# EAGLE schematic HDMI_DLT (EAGLE 9.4.2)
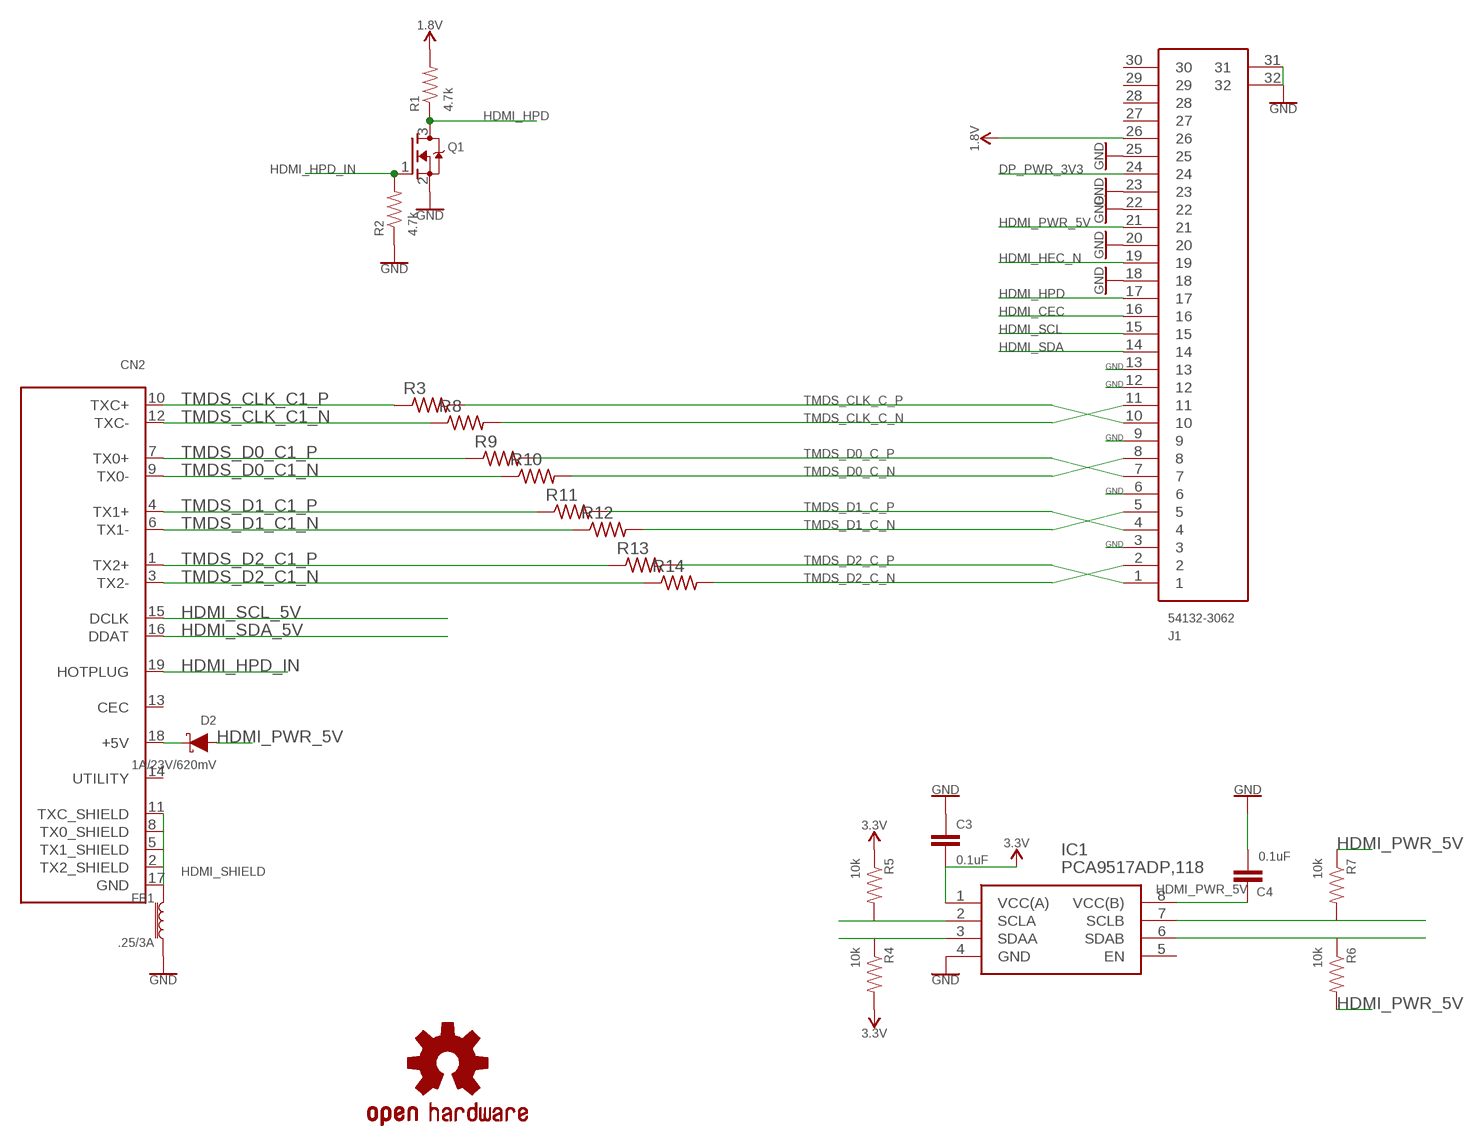
[diagram p0: schematic, sheet 1]

## Parts
C3  0.1uF  10NF-0603-50V-10%  [0603]
C4  0.1uF  10NF-0603-50V-10%  [0603]
CN2  HDMI_MOLEX_47151-0001  [HDMI_MOLEX_47151-0001]
D2  1A/23V/620mV  DIODE-SCHOTTKY-BAT20J  [SOD-323]
FB1  .25/3A  FERRITE_BEAD-0603  [0603]
IC1  PCA9517ADP,118  [SOP65P490X110-8N]
J1  54132-3062  [54132-3062]
LOGO1  OSHW-LOGOS-COPPER  [OSHW-LOGO-S_COPPER]
Q1  MOSFET-NWAVE  [SOT23-W]
R1  4.7k  RESISTOR0805-RES  [0805]
R2  4.7k  RESISTOR0805-RES  [0805]
R3  R-US_R0402  [R0402]
R4  10k  RESISTOR0805-RES  [0805]
R5  10k  RESISTOR0805-RES  [0805]
R6  10k  RESISTOR0805-RES  [0805]
R7  10k  RESISTOR0805-RES  [0805]
R8  R-US_R0402  [R0402]
R9  R-US_R0402  [R0402]
R10  R-US_R0402  [R0402]
R11  R-US_R0402  [R0402]
R12  R-US_R0402  [R0402]
R13  R-US_R0402  [R0402]
R14  R-US_R0402  [R0402]

## Nets
1.8V: J1.26 R1.2
3.3V: C3.2 IC1.1(VCC(A)) R4.2 R5.1
DP_PWR_3V3: J1.24
GND: C3.1 C4.2 FB1.2 IC1.4(GND) J1.3 J1.6 J1.9 J1.12 J1.13 J1.18 J1.20 J1.22 J1.23 J1.25 J1.31 J1.32 Q1.2(S) R2.1
HDMI_5V_DIODE1: CN2.18(+5V) D2.C
HDMI_CEC: J1.16
HDMI_HEC_N: J1.19
HDMI_HPD: J1.17 Q1.3(D) R1.1
HDMI_HPD_IN: CN2.19(HOTPLUG) Q1.1(G) R2.2
HDMI_PWR_5V: C4.1 D2.A IC1.8(VCC(B)) J1.21 R6.2 R7.1
HDMI_SCL: IC1.2(SCLA) J1.15 R5.2
HDMI_SCL_5V: CN2.15(DCLK) IC1.7(SCLB) R7.2
HDMI_SDA: IC1.3(SDAA) J1.14 R4.1
HDMI_SDA_5V: CN2.16(DDAT) IC1.6(SDAB) R6.1
HDMI_SHIELD: CN2.2(TX2_SHIELD) CN2.5(TX1_SHIELD) CN2.8(TX0_SHIELD) CN2.11(TXC_SHIELD) CN2.17(GND) FB1.1
TMDS_CLK_C1_N: CN2.12(TXC-) R8.1
TMDS_CLK_C1_P: CN2.10(TXC+) R3.1
TMDS_CLK_C_N: J1.11 R8.2
TMDS_CLK_C_P: J1.10 R3.2
TMDS_D0_C1_N: CN2.9(TX0-) R10.1
TMDS_D0_C1_P: CN2.7(TX0+) R9.1
TMDS_D0_C_N: J1.8 R10.2
TMDS_D0_C_P: J1.7 R9.2
TMDS_D1_C1_N: CN2.6(TX1-) R12.1
TMDS_D1_C1_P: CN2.4(TX1+) R11.1
TMDS_D1_C_N: J1.5 R12.2
TMDS_D1_C_P: J1.4 R11.2
TMDS_D2_C1_N: CN2.3(TX2-) R14.1
TMDS_D2_C1_P: CN2.1(TX2+) R13.1
TMDS_D2_C_N: J1.2 R14.2
TMDS_D2_C_P: J1.1 R13.2
Unconnected: CN2.13(CEC) CN2.14(UTILITY) IC1.5(EN) J1.27 J1.28 J1.29 J1.30

## Power pins joined to a net without a drawn wire
GND: CN2.P$1(GND) CN2.P$2(GND) CN2.P$3(GND) CN2.P$4(GND)

## Library data of the parts
C3 C4 = SparkFun-Capacitors:10NF: 0.01uF/10nF/10,000pF ceramic capacitors A capacitor is a passive two-terminal electrical component used to store electrical energy temporarily in an electric field. CAP-09321; PROD_ID: CAP-00867; VALUE: 10nF
CN2 = microbuilder:HDMI_MOLEX_47151-0001
D2 = SparkFun-DiscreteSemi:DIODE-SCHOTTKY: Schottky diode A Schottky diode is a semiconductor diode which has a low forward voltage drop and a very fast switching action.; PROD_ID: DIO-11623
FB1 = SparkFun-Coils:FERRITE_BEAD: Ferrite Bead (blocks, cores, rings, chokes, etc.) Inductor with layers of ferrite used to suppress high frequencies. Often used to isolate high frequency noise. SparkFun Products: IOIO-OTG - V2.2 <https://www.sparkfun.com/products/13613> SparkFun SAMD21 Mini Breakout <https://www.sparkfun.com/products/13664> SparkFun 6 Degrees of Freedom Breakout - LSM6DS3 <https://www.sparkfun.com/products/13339> SparkFun SAMD21 Dev Breakout <https://www.sparkfun.com/products/13672>; PROD_ID: NDUC-13805; VALUE: 30Ω/1.8A
IC1 = SamacSys_Parts:PCA9517ADP,118: PCA9517ADP,118, Bus Repeater I2C, 8-Pin TSSOP Source: Datasheet <https://componentsearchengine.com/Datasheets/1/PCA9517ADP,118.pdf>; DESCRIPTION: PCA9517ADP,118, Bus Repeater I2C, 8-Pin TSSOP; HEIGHT: 1.1mm; MANUFACTURER_NAME: Nexperia; MANUFACTURER_PART_NUMBER: PCA9517ADP,118; MOUSER_PART_NUMBER: 771-PCA9517ADP118; MOUSER_PRICE-STOCK: https://www.mouser.com/Search/Refine.aspx?Keyword=771-PCA9517ADP118
J1 = 54132-3062:54132-3062: Connector 0.5mm, FFC/FPC, SMT,r/a,30w,Au Molex FFC/FPC SMT Series 0.5mm Pitch 30 Way Right Angle SMT Female FPC Connector, ZIF Bottom Contact Source: Datasheet <https://componentsearchengine.com/Datasheets/1/54132-3062.pdf>; DESCRIPTION: Connector 0.5mm, FFC/FPC, SMT,r/a,30w,Au Molex FFC/FPC SMT Series 0.5mm Pitch 30 Way Right Angle SMT Female FPC Connector, ZIF Bottom Contact; HEIGHT: mm; MANUFACTURER_NAME: Molex; MANUFACTURER_PART_NUMBER: 54132-3062; MOUSER_PART_NUMBER: 538-54132-3062; MOUSER_PRICE-STOCK: https://www.mouser.com/Search/Refine.aspx?Keyword=538-54132-3062
LOGO1 = SparkFun-Aesthetics:OSHW-LOGO: Open-Source Hardware (OSHW) Logo This logo indicates the piece of hardware it is found on incorporates a OSHW license and/or adheres to the definition of open source hardware found here: http://freedomdefined.org/OSHW
Q1 = microbuilder:MOSFET-N: N-Channel Mosfet LEGEND VDS: Voltage Drain-Source ID: Drain Current RDS(ON): Drain-Source On-State Resistance VGS(TH): Gate-Source Threshold Voltage CISS: Drain-Source Input Capacitance SOT-23 Name VDS ID RDS(ON) VGS(TH) CISS Order Number 2N7002E 60V 260mA 2.5 Ohm 2.5V @ 250uA 26.7pF @ 25V 2N7002ET1GOSTR-ND BSH103 30V 850mA 400 mOhm 400mV @ 1mA 83pF @ 24V BSH103,235-ND BSS138 60V 320mA 1.6 Ohm 1.5V @ 250uA 50pF @ 10V Mouser: 771-BSS138PW115 DMN2075U-7 20V 4.2A 38 mOhm 1V @ 250 uA 594.3pF @ 10V DMN2075U-7DICT-ND * BSS138 good choice for I2C level-shifting
R1 R2 R4-R7 = SparkFun-Passives:RESISTOR: Resistor Basic schematic elements and footprints for 0603, 1206, and PTH resistors.
R3 R8-R14 = resistor:R-US_: RESISTOR, American symbol